# Altium project JLink_ARM-OB_072.PrjPCB
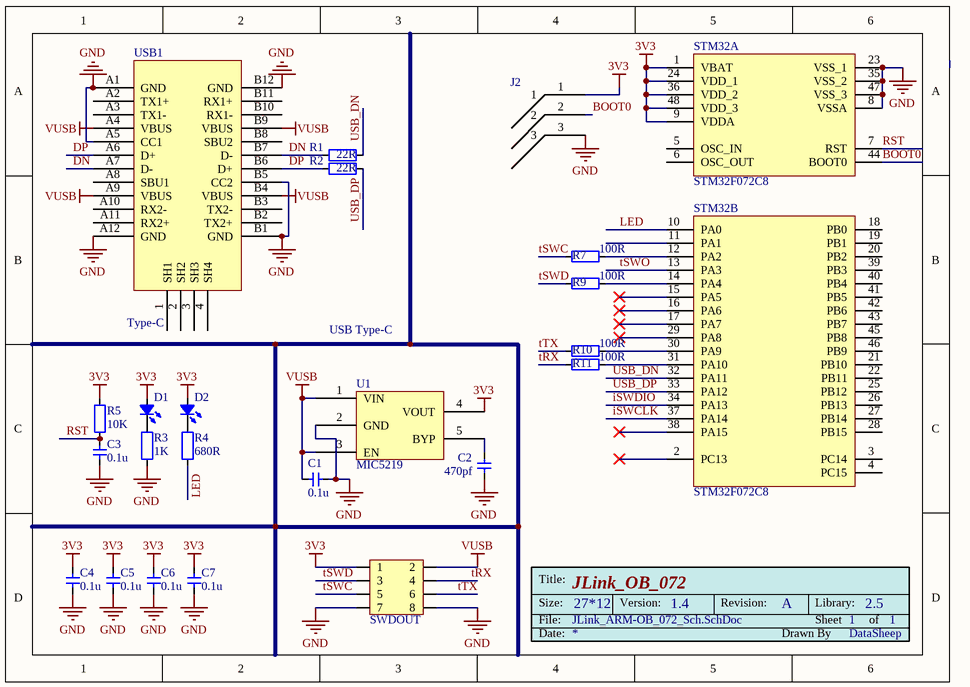
[diagram p0: JLink_ARM-OB_072_Sch.SchDoc]
1 sheet, 23 parts. Net scope: global (net labels, ports and power ports of the same name join across sheets).
Board file: JLink_ARM-OB_072_Pcb(Type-C).PcbDoc

## Sheet JLink_ARM-OB_072_Sch.SchDoc: Jlink_ARM-OB 072
size 177 x 127 mm; Author: Hom; CompanyName: KitSprout; DrawnBy: Hom; Engineer: Hom; Organization: KitSprout; Revision: A; SheetNumber: 1; SheetTotal: 1; Version: 1.0; LibVersion: 2.5

### Parts
C1  value 0.1u  [CAP_0603]  (hidden comment: Cap_0603)
C2  value 470pf  [CAP_0603]  (hidden comment: Cap_0603)
C3  value 0.1u  [CAP_0603]  (hidden comment: Cap_0603)
C4  value 0.1u  [CAP_0603]  (hidden comment: Cap_0603)
C5  value 0.1u  [CAP_0603]  (hidden comment: Cap_0603)
C6  value 0.1u  [CAP_0603]  (hidden comment: Cap_0603)
C7  value 0.1u  [CAP_0603]  (hidden comment: Cap_0603)
D1  LED_0603  [0603/LED]  (value not drawn)
D2  LED_0603  [0603/LED]  (value not drawn)
J2  (no value)  [test]
R1  value 22R  [RES_0603]  (hidden comment: Res_0603)
R2  value 22R  [RES_0603]  (hidden comment: Res_0603)
R3  value 1K  [RES_0603]  (hidden comment: Res_0603)
R4  value 680R  [RES_0603]  (hidden comment: Res_0603)
R5  value 10K  [RES_0603]  (hidden comment: Res_0603)
R7  value 100R  [RES_0603]  (hidden comment: Res_0603)
R9  value 100R  [RES_0603]  (hidden comment: Res_0603)
R10  value 100R  [RES_0603]  (hidden comment: Res_0603)
R11  value 100R  [RES_0603]  (hidden comment: Res_0603)
STM32  STM32F072C8  [LQFP_P0.5_48]  (parts A,B of 2)
SWDOUT  HDR2x4_2.54  [HDR2X4_2.54_180H]  (value not drawn)
U1  MIC5219  [SOT23-5]
USB1  Type-C  [Type-C]

### Nets
3V3: C4.2 C5.2 C6.2 C7.2 D1.1(A) D2.1(A) J2.1 R5.2 STM32.1(VBAT) STM32.9(VDDA) STM32.24(VDD_1) STM32.36(VDD_2) STM32.48(VDD_3) SWDOUT.1 U1.4(VOUT)
GND: C1.1 C2.1 C3.1 C4.1 C5.1 C6.1 C7.1 J2.3 R3.1 STM32.8(VSSA) STM32.23(VSS_1) STM32.35(VSS_2) STM32.47(VSS_3) SWDOUT.7 SWDOUT.8 U1.2(GND) USB1.A1(GND) USB1.A5(CC1) USB1.A12(GND) USB1.B1(GND) USB1.B5(CC2) USB1.B12(GND)
VUSB: C1.2 SWDOUT.2 U1.1(VIN) U1.3(EN) USB1.A4(VBUS) USB1.A9(VBUS) USB1.B4(VBUS) USB1.B9(VBUS)
BOOT0: J2.2 STM32.44(BOOT0)
DN: R1.1 USB1.A7(D-) USB1.B7(D-)
DP: R2.1 USB1.A6(D+) USB1.B6(D+)
iSWCLK: STM32.37(PA14)
iSWDIO: STM32.34(PA13)
LED: R4.1 STM32.10(PA0)
RST: C3.2 R5.1 STM32.7(RST)
tRX: R11.1 SWDOUT.4
tSWC: R7.1 SWDOUT.5
tSWD: R9.1 SWDOUT.3
tSWO: STM32.13(PA3)
tTX: R10.1 SWDOUT.6
USB_DN: R1.2 STM32.32(PA11)
USB_DP: R2.2 STM32.33(PA12)
NetC2_2: C2.2 U1.5(BYP)
NetD1_2: D1.2(K) R3.2
NetD2_2: D2.2(K) R4.2
NetR7_2: R7.2 STM32.12(PA2)
NetR9_2: R9.2 STM32.14(PA4)
NetR10_2: R10.2 STM32.30(PA9)
NetR11_2: R11.2 STM32.31(PA10)

Not connected (* = marked no-connect by the designer): STM32 2(PC13)* 3(PC14) 4(PC15) 5(OSC_IN) 6(OSC_OUT) 11(PA1) 15(PA5)* 16(PA6)* 17(PA7)* 18(PB0) 19(PB1) 20(PB2) 21(PB10) 22(PB11) 25(PB12) 26(PB13) 27(PB14) 28(PB15) 29(PA8)* 38(PA15)* 39(PB3) 40(PB4) 41(PB5) 42(PB6) 43(PB7) 45(PB8) 46(PB9); USB1 1(SH1) 2(SH2) 3(SH3) 4(SH4) A2(TX1+) A3(TX1-) A8(SBU1) A10(RX2-) A11(RX2+) B2(TX2+) B3(TX2-) B8(SBU2) B10(RX1-) B11(RX1+)

### Notes on the sheet
- USB Type-C
- Title:
- Size:
- Date:
- File:
- JLink_OB_072
- 27*12
- Version:
- 1.4
- Revision:
- Drawn By
- Sheet
- Library:
- DataSheep
- of

### Library data of the parts
C1-C7 = Cap_0603: Capacitor
D1 D2 = LED_0603: LED
J2 = 测试点
R1-R5 R7 R9-R11 = Res_0603: Resistor
STM32 = STM32F103C: MCU
SWDOUT = HDR2x4_2.54: Header